# Altium schematic sheet [05]BuckConverter.SchDoc
size A4; SheetNumber: 4; SheetTotal: 5
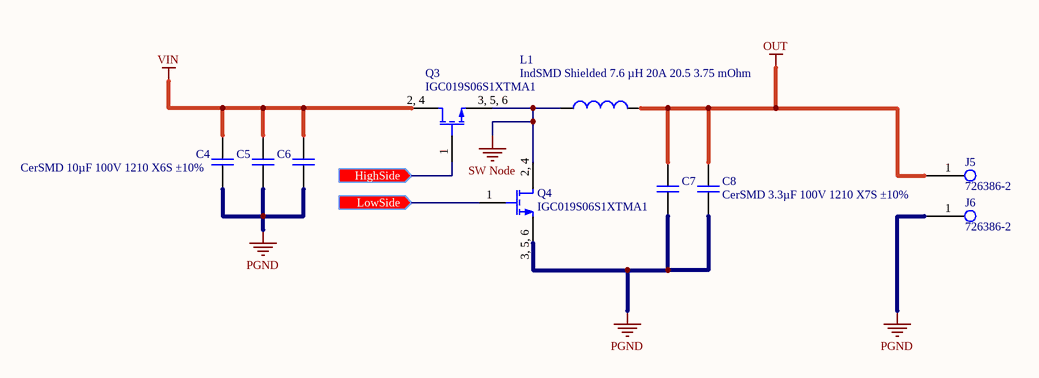
[diagram p0: [05]BuckConverter.SchDoc]

## Parts
C4  CerSMD 10µF 100V 1210 X6S ±10%  [CAPC3216X18N]
C5  CerSMD 10µF 100V 1210 X6S ±10%  [CAPC3216X18N]  (value not drawn)
C6  CerSMD 10µF 100V 1210 X6S ±10%  [CAPC3216X18N]  (value not drawn)
C7  CerSMD 3.3µF 100V 1210 X7S ±10%  [CAPC3225X28N]  (value not drawn)
C8  CerSMD 3.3µF 100V 1210 X7S ±10%  [CAPC3225X28N]
J5  726386-2  [1844210]
J6  726386-2  [1844210]
L1  IndSMD Shielded 7.6 µH 20A 20.5 3.75 mOhm  [7443557760]
Q3  IGC019S06S1XTMA1  [IGC019S06S1XTMA1]
Q4  IGC019S06S1XTMA1  [IGC019S06S1XTMA1]

## Ports
HighSide (in, see [03]GateDriver[3B]), LowSide (in, see [03]GateDriver[3C])

## Nets
OUT: C7.1 C8.1 J5.1 L1.2
PGND: C4.2 C5.2 C6.2 C7.2 C8.2 J6.1 Q4.3,_5,_6(S)
SW Node: L1.1 Q3.3,_5,_6(S) Q4.2,_4(D)
VIN: C4.1 C5.1 C6.1 Q3.2,_4(D)
HighSide: Q3.1(G) ; port HighSide
LowSide: Q4.1(G) ; port LowSide

## Notes on the sheet
- Title:
- Size:
- Date:
- A4
- Number:
- Time:
- Revision:
- Sheet
- of
- Project
- Drawn By :

## Library data of the parts
C4-C6 = CMP-000078-1: Ceramic Capacitor SMD 10µF 100V 1210 X6S ±10%; Manufacturer: TDK Corporation; Manufacturer Number: C3216X6S2A106K160AC; Temperature Coefficient: X7R; Voltage: 16V; Mounting Type: Surface Mount; Digi-Key Part Number: C3216X6S2A106K160AC; Tolerance: ±10%; Farnell Number: 4066660; Package: 0603; Temperature: -55°C up to 125°C; Mouser Part Number: 810-C3216X6S2A106K16
C7 C8 = CMP-00010-1: Ceramic Capacitor SMD 3.3µF 100V 1210 X7S ±10%; Manufacturer: Samsung Electro-Mechanics; Manufacturer Number: C3225X7S2A335K200AB; Voltage: 16V; Temperature Coefficient: X7R; Farnell Number: 2476113; Digi-Key Part Number: 445-5209-1-ND; Temperature: -55°C up to 125°C; Tolerance: ±10%; Mounting Type: Surface Mount; Package: 0603; Mouser Part Number: 810-C3225X7S2A335K
J5 J6 = CMP-00026-1
L1 = CMP-00011-1: Inductor SMD Shielded 7.6 µH 20A 20.5 3.75 mOhm
Q3 Q4 = CMP-00009-5: GaNFET N-Ch - 60V - 27A (Ta), 99A (Tc); Manufacturer: Infineon Technologies; Vgs(max): ±6.5V; Rdson: 1.9mOhm; Vgs(th): 2.9V; Drive Voltage: 5V; FET Type: N-Channel; Package: PG-TSON-6-2; Mouser Part Number: 726-IGC019S06S1XTMA1; Digi-Key Part Number: 448-IGC019S06S1XTMA1CT-ND; Farnell Part Number: 4680815; Manufacturer Number: IGC019S06S1XTMA1; Vdss: 60V; Ids: 27A (Ta), 99A (Tc); Mounting Type: Surface Mount; Operating Temperature: -40°C up to 150°C (TJ)